# Altium schematic sheet Audio.SchDoc
size A4; SheetNumber: 5; SheetTotal: 8
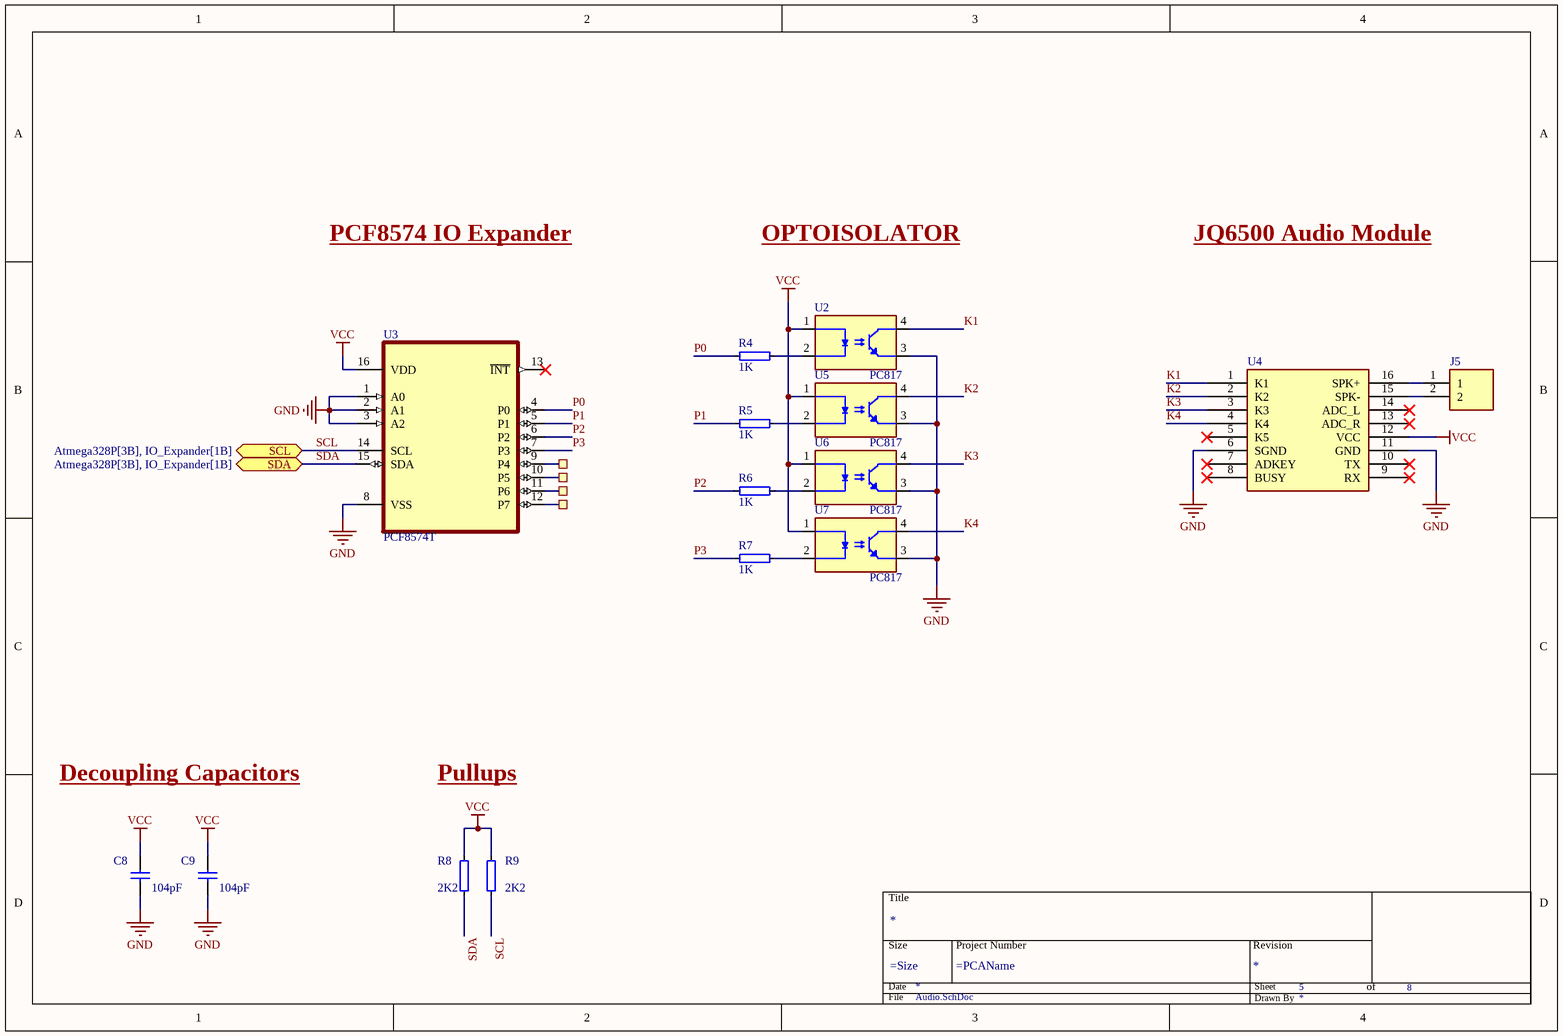
[diagram p0: Audio.SchDoc]

## Parts
*  Title Block  (value not drawn)  (graphical)
C8  104pF  [CAPC2012X140N]
C9  104pF  [CAPC2012X140N]
J5  CONN HEADER VERT 2POS 2.5MM  [JST_B2B-XH-A(LF)(SN)]  (value not drawn)
R4  1K  [RESC2012X65N]
R5  1K  [RESC2012X65N]
R6  1K  [RESC2012X65N]
R7  1K  [RESC2012X65N]
R8  2K2  [RESC2012X65N]
R9  2K2  [RESC2012X65N]
TP11  TP  [TESTPAD-TH]  (value not drawn)  (no BOM)
TP12  TP  [TESTPAD-TH]  (value not drawn)  (no BOM)
TP13  TP  [TESTPAD-TH]  (value not drawn)  (no BOM)
TP14  TP  [TESTPAD-TH]  (value not drawn)  (no BOM)
U2  PC817  [DIP762W50P254L495H455Q4]
U3  PCF8574T  [SOIC127P1032X265-16N]
U4  JQ6500  [JQ6500]  (value not drawn)
U5  PC817  [DIP762W50P254L495H455Q4]
U6  PC817  [DIP762W50P254L495H455Q4]
U7  PC817  [DIP762W50P254L495H455Q4]

## Ports
SCL (bidir, see Atmega328P[3B], IO_Expander[1B]), SDA (bidir, see Atmega328P[3B], IO_Expander[1B])

## Nets
GND: C8.1 C9.1 U2.3(EMITTER) U3.1(A0) U3.2(A1) U3.3(A2) U3.8(VSS) U4.6(SGND) U4.11(GND) U5.3(EMITTER) U6.3(EMITTER) U7.3(EMITTER)
VCC: C8.2 C9.2 R8.2 R9.2 U2.1(ANODE) U3.16(VDD) U4.12(VCC) U5.1(ANODE) U6.1(ANODE) U7.1(ANODE)
K1: U2.4(COLLECTOR) U4.1(K1)
K2: U4.2(K2) U5.4(COLLECTOR)
K3: U4.3(K3) U6.4(COLLECTOR)
K4: U4.4(K4) U7.4(COLLECTOR)
P0: R4.2 U3.4(P0)
P1: R5.2 U3.5(P1)
P2: R6.2 U3.6(P2)
P3: R7.2 U3.7(P3)
SCL: R9.1 U3.14(SCL) ; port SCL
SDA: R8.1 U3.15(SDA) ; port SDA
NetJ5_1: J5.1 U4.16(SPK+)
NetJ5_2: J5.2 U4.15(SPK-)
NetR4_1: R4.1 U2.2(CATHODE)
NetR5_1: R5.1 U5.2(CATHODE)
NetR6_1: R6.1 U6.2(CATHODE)
NetR7_1: R7.1 U7.2(CATHODE)
NetTP11_1: TP11.1 U3.9(P4)
NetTP12_1: TP12.1 U3.10(P5)
NetTP13_1: TP13.1 U3.11(P6)
NetTP14_1: TP14.1 U3.12(P7)

Not connected (* = marked no-connect by the designer): U3 13(~{INT})*; U4 5(K5)* 7(ADKEY)* 8(BUSY)* 9(RX)* 10(TX)* 13(ADC_R)* 14(ADC_L)*

## Notes on the sheet
- PCF8574 IO Expander
- OPTOISOLATOR
- JQ6500 Audio Module
- Decoupling Capacitors
- Pullups
- (in symbol Title Block) Title; Size; Project Number; Revision; Date; Sheet; of; File; Drawn By

## Library data of the parts
C8 C9 = CAP_0805: Part Number: CAP_0805; Pin Count: 2; Publisher: Metal Circuits; Value: 104pF
J5 = B2B-XH-A(LF)(SN): Connector Header Through Hole 2 position 0.098" (2.50mm); Manufacturer: JST Sales America Inc.; Part Number: B2B-XH-A(LF)(SN); Manufacturer Part Number: B2B-XH-A(LF)(SN); Pin Count: 2; Publisher: Metal Circuits; Value: CONN HEADER VERT 2POS 2.5MM; HelpURL: https://www.jst-mfg.com/product/pdf/eng/eXH.pdf; Supplier 1: Digi-Key; Supplier Part Number 1: 455-2247-ND
R4-R9 = RES_0805: RES SMD 1% 1/10W 0805; Part Number: RES_0805; Pin Count: 2; Publisher: Metal Circuits; FootPrint Doc: 0805
  R4-R7: Value: 1K
  R8 R9: Value: 2K2
TP11-TP14 = TESTPAD_TH: Testpoint, through hole; Part Number: Testpoint TH; Artikkelnr Noca: N.A.; Manufacturer: *; Manufacturer Part Number: *; Datasheet: *; Footprint Doc: TESTPAD-TH; LatestRevisionDate: 2009-12-12; Pin Count: 1; Publisher: Nordic Semiconductor; Published: 2009-12-12; Value: TP; Note: *; Supplier: *; Supplier part number: *; 2nd source Supplier: *; 2nd source part number: *; Artikkelnr Simpro: N.A.
U2 U5-U7 = PC817: Optoisolator Transistor Output - 1 Channel 4-DIP; Manufacturer: SHARP; Part Number: PC817; Manufacturer Part Number: PC817; Pin Count: 4; Publisher: Metal Circuits; Value: PC817; FootPrint Doc: DIP-4
U3 = PCF8574T/3,518: IC XPNDR 100KHZ I2C 16SO; Manufacturer: NXP; Part Number: PCF8574T/3,518; Manufacturer Part Number: PCF8574T/3,518; Pin Count: 16; Publisher: Metal Circuits; Value: PCF8574T; FootPrint Doc: SOIC-16
U4 = JQ6500: JQ6500-16P with onboard 16Mbit (2 Mega Byte) Flash memory.; Part Number: JQ6500; Manufacturer Part Number: JQ6500; Pin Count: 16; Publisher: Metal Circuits; Value: JQ6500